# EAGLE design Adafruit CAN Bus FeatherWing (EAGLE 9.6.2)
COMPANY: Adafruit Industries; DRAWN: Bryan Siepert; REV: A
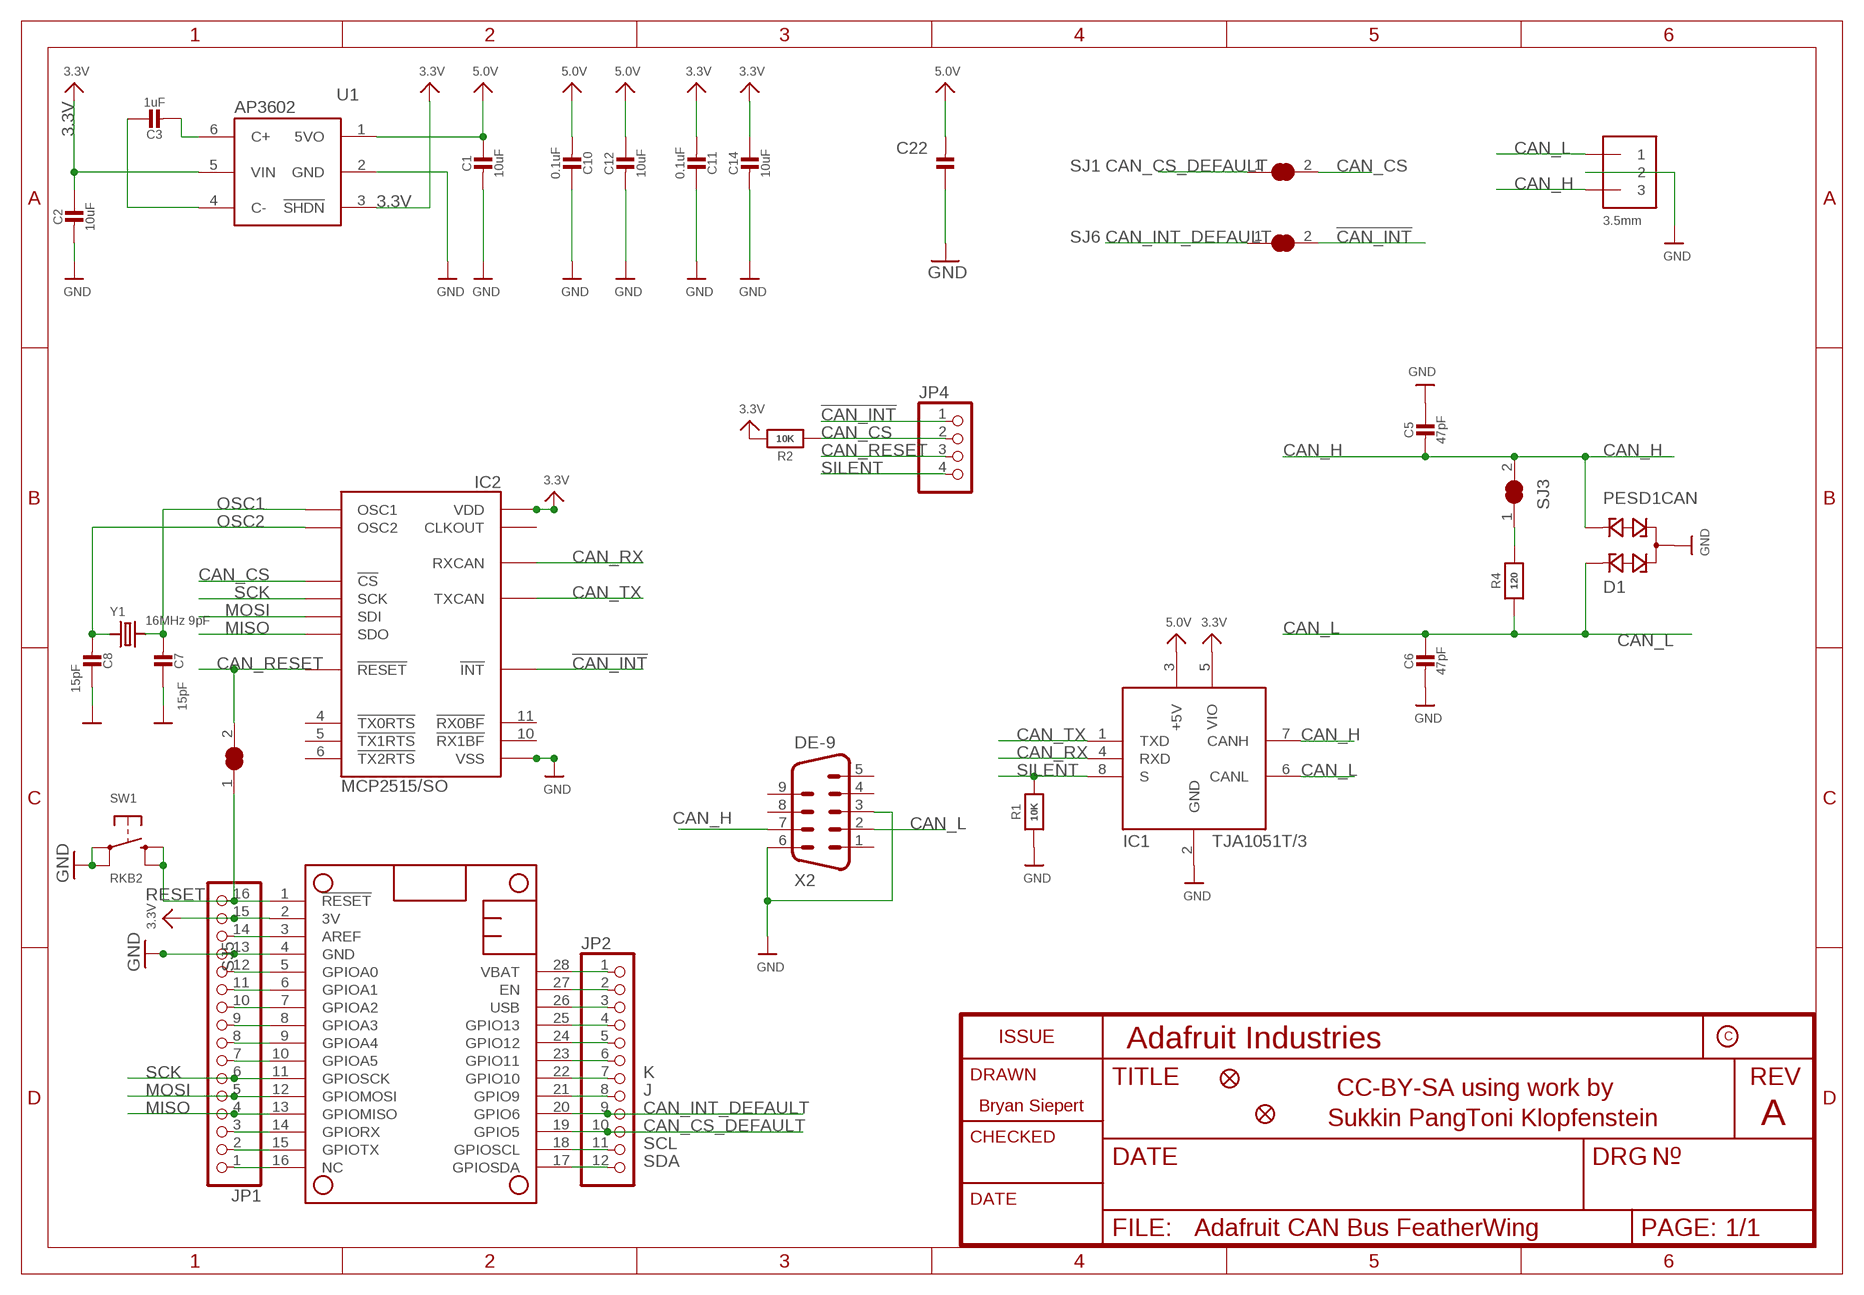
[diagram p0: schematic, sheet 1]

## Parts
C1  10uF  CAP_CERAMIC0805-NOOUTLINE  [0805-NO]
C2  10uF  CAP_CERAMIC0805-NOOUTLINE  [0805-NO]
C3  1uF  CAP_CERAMIC0805-NOOUTLINE  [0805-NO]
C5  47pF  CAP_CERAMIC0603_NO  [0603-NO]
C6  47pF  CAP_CERAMIC0603_NO  [0603-NO]
C7  15pF  CAP_CERAMIC0603_NO  [0603-NO]
C8  15pF  CAP_CERAMIC0603_NO  [0603-NO]
C10  0.1uF  CAP_CERAMIC0603_NO  [0603-NO]
C11  0.1uF  CAP_CERAMIC0603_NO  [0603-NO]
C12  10uF  CAP_CERAMIC0805-NOOUTLINE  [0805-NO]
C14  10uF  CAP_CERAMIC0805-NOOUTLINE  [0805-NO]
C22  0.1uF  CAP_CERAMIC0603_NO  [0603-NO]
D1  PESD1CAN  [SOT23]
FID2  FIDUCIAL_1MM  [FIDUCIAL_1MM]
FID3  FIDUCIAL_1MM  [FIDUCIAL_1MM]
IC1  TJA1051T/3  CAN_TRANSCIEVER_TCAN1051V  [SOIC8_150MIL]
IC2  MCP2515/SO  [SOIC18WIDE]
JP1  HEADER-1X16ROUND  [1X16_ROUND]
JP2  HEADER-1X12  [1X12_ROUND]
JP4  HEADER-1X4ROUND  [1X04_ROUND]
MS1  FEATHERWING_NODIM  [FEATHERWING_NODIM]
NEOPIX1  3.5mm  TERMBLOCK_1X3  [TERMBLOCK_1X3-3.5MM]
R1  10K  RESISTOR_0603_NOOUT  [0603-NO]
R2  10K  RESISTOR_0603_NOOUT  [0603-NO]
R4  120  RESISTOR_0603_NOOUT  [0603-NO]
SJ1  SOLDERJUMPER_CLOSED  [SOLDERJUMPER_CLOSEDWIRE]
SJ3  SOLDERJUMPER_CLOSED  [SOLDERJUMPER_CLOSEDWIRE]
SJ5  SOLDERJUMPER_CLOSED  [SOLDERJUMPER_CLOSEDWIRE]
SJ6  SOLDERJUMPER_CLOSED  [SOLDERJUMPER_CLOSEDWIRE]
SW1  RKB2  SWITCH_TACT_SMT_RKB2  [BTN_RKB2_4.6X2.8]
U1  AP3602  [SOT23-6]
X2  DE-9  M09D  [M09D]
Y1  16MHz 9pF  CRYSTAL3.2X2.5  [CRYSTAL_3.2X2.5]

## Nets
3.3V: C2.1 C11.2 C14.1 IC1.5(VIO) IC2.18(VDD) JP1.15 MS1.2(3V) R2.2 U1.3(!SHDN) U1.5(VIN)
5.0V: C1.1 C10.2 C12.1 C22.2 IC1.3(+5V) U1.1(5VO)
!CAN_INT: IC2.12(!INT) JP4.1 SJ6.2
A: JP1.12 MS1.5(GPIOA0)
AREF: JP1.14 MS1.3(AREF)
B: JP1.11 MS1.6(GPIOA1)
C: JP1.10 MS1.7(GPIOA2)
CAN_CS: IC2.16(!CS) JP4.2 R2.1 SJ1.2
CAN_CS_DEFAULT: JP2.10 MS1.19(GPIO5) SJ1.1
CAN_H: C5.2 D1.2 IC1.7(CANH) NEOPIX1.3 SJ3.2 X2.7
CAN_INT_DEFAULT: JP2.9 MS1.20(GPIO6) SJ6.1
CAN_L: C6.1 D1.1 IC1.6(CANL) NEOPIX1.1 R4.1 X2.2
CAN_RESET: IC2.17(!RESET) JP4.3 SJ5.2
CAN_RX: IC1.4(RXD) IC2.2(RXCAN)
CAN_TX: IC1.1(TXD) IC2.1(TXCAN)
D: JP1.9 MS1.8(GPIOA3)
E: JP1.8 MS1.9(GPIOA4)
EN: JP2.2 MS1.27(EN)
F: JP1.7 MS1.10(GPIOA5)
G: JP1.1 MS1.16(NC)
GND: C1.2 C2.2 C5.1 C6.2 C7.1 C8.1 C10.1 C11.1 C12.2 C14.2 C22.1 D1.3 IC1.2(GND) IC2.9(VSS) JP1.13 MS1.4(GND) NEOPIX1.2 R1.1 SW1.A'(P1) SW1.A(P) U1.2(GND) X2.3 X2.6
J: JP2.8 MS1.21(GPIO9)
K: JP2.7 MS1.22(GPIO10)
L: JP2.6 MS1.23(GPIO11)
M: JP2.5 MS1.24(GPIO12)
MISO: IC2.15(SDO) JP1.4 MS1.13(GPIOMISO)
MOSI: IC2.14(SDI) JP1.5 MS1.12(GPIOMOSI)
N: JP2.4 MS1.25(GPIO13)
N$1: C3.2 U1.6(C+)
N$2: C3.1 U1.4(C-)
N$3: R4.2 SJ3.1
OSC1: C7.2 IC2.8(OSC1) Y1.2
OSC2: C8.2 IC2.7(OSC2) Y1.1
RESET: JP1.16 MS1.1(!RESET) SJ5.1 SW1.B'(S1) SW1.B(S)
RX: JP1.3 MS1.14(GPIORX)
SCK: IC2.13(SCK) JP1.6 MS1.11(GPIOSCK)
SCL: JP2.11 MS1.18(GPIOSCL)
SDA: JP2.12 MS1.17(GPIOSDA)
SILENT: IC1.8(S) JP4.4 R1.2
TX: JP1.2 MS1.15(GPIOTX)
USB: JP2.3 MS1.26(USB)
VBAT: JP2.1 MS1.28(VBAT)
Unconnected: IC2.3(CLKOUT) IC2.4(!TX0RTS) IC2.5(!TX1RTS) IC2.6(!TX2RTS) IC2.10(!RX1BF) IC2.11(!RX0BF) X2.1 X2.4 X2.5 X2.8 X2.9

## Notes on the sheet
- CC-BY-SA using work by
- Toni Klopfenstein
- Sukkin Pang

## Library data of the parts
C1-C3 C5-C8 C10-C12 C14 C22 = microbuilder:CAP_CERAMIC: Ceramic Capacitors For new designs, use the packages preceded by an '_' character since they are more reliable: The following footprints should be used on most boards: _0402 - Standard footprint for regular board layouts _0603 - Standard footprint for regular board layouts _0805 - Standard footprint for regular board layouts _1206 - Standard footprint for regular board layouts For extremely tight-pitch boards where space is at a premium, the following 'micro-pitch' footprints can be used (smaller pads, no silkscreen outline, etc.): _0402MP - Micro-pitch footprint for very dense/compact boards _0603MP - Micro-pitch footprint for very dense/compact boards _0805MP - Micro-pitch footprint for very dense/compact boards _1206MP - Micro-pitch footprint for very dense/compact boards
D1 = diode:PESD1CAN: CAN bus ESD protection diode Source: http://www.nxp.com/documents/data_sheet/PESD1CAN.pdf
FID2 FID3 = microbuilder:FIDUCIAL: Fiducial Alignment Points Various fiducial points for machine vision alignment.; BOM: EXCLUDE
IC1 = microbuilder:CAN_TRANSCIEVER
IC2 = microbuilder:MCP2515
JP1 = microbuilder:HEADER-1X16: PIN HEADER
JP2 = microbuilder:HEADER-1X12
JP4 = microbuilder:HEADER-1X4: PIN HEADER
MS1 = microbuilder:FEATHERWING
NEOPIX1 = adafruit_electromech:TERMBLOCK_1X3: 3.5mm Terminal block http://www.ladyada.net/library/pcb/eaglelibrary.html
R1 R2 R4 = microbuilder:RESISTOR: Resistors For new designs, use the packages preceded by an '_' character since they are more reliable: The following footprints should be used on most boards: _0402 - Standard footprint for regular board layouts _0603 - Standard footprint for regular board layouts _0805 - Standard footprint for regular board layouts _1206 - Standard footprint for regular board layouts For extremely tight-pitch boards where space is at a premium, the following 'micro-pitch' footprints can be used (smaller pads, no silkscreen outline, etc.): _0402MP - Micro-pitch footprint for very dense/compact boards _0603MP - Micro-pitch footprint for very dense/compact boards _0805MP - Micro-pitch footprint for very dense/compact boards _1206MP - Micro-pitch footprint for very dense/compact boards
SJ1 SJ3 SJ5 SJ6 = microbuilder:SOLDERJUMPER_CLOSED: Solder Jumper - Closed These solder jumpers are closed by default CLOSEDWIRE - 10 mil trace between pads that can be cut and resoldered later CLOSEDPERM - 63 mil trace between pads for a permanent connection (used to 'bridge' two signals, a shameless hack for Eagle). Can double as a test point as well (no cream layer)
SW1 = adafruit_electromech:SWITCH_TACT_SMT: SMT Tact Switches RKB2 https://www.digikey.com/short/m027prz5
U1 = microbuilder:AP3602
X2 = adafruit_electromech:M09: SUB-D; OC_FARNELL: unknown; OC_NEWARK: unknown
Y1 = microbuilder:CRYSTAL: Crystals HC49UP - Surface Mount Crystal 4.0MHz 18pF +/-30ppm Surface Mount Crystal [Digikey: 535-9857-1-ND] 12.0 MHz Surface Mount Crystal [Digikey: 535-9869-6-ND] 25.0 MHz Surface Mount Crystal [Digikey: 535-9078-1-ND] 2.5 x 2.0mm - MEMs SMT Crystal 16.0 MHz 10pF 20ppm 2.5 x 2.0mm Crystal [Digikey -40-85°C: 535-10923-1-ND] 3.2 x 2.5mm - MEMs SMT Crystal 12.0 MHz 8pF 15ppm 3.2 x 2.5mm Crystal [Digikey: -10-70°C: 644-1047-1-ND -40-125°C: 644-1128-1-ND] 40~85°C cheaper: 644-1173-6-ND 16.0 MHz 8pF 15ppm 3.2 x 2.5mm Crystal [Digikey: -10-70°C: 644-1049-1-ND -40-125°C: 644-1129-2-ND]-40~85°C cheaper: 644-1175-6-ND 16.0 MHz 10pF 10ppm 3.2 x 2.5mm Crystal [Digikey: 644-1100-1-ND] 27.12 MHz 18pF 30ppm 3.2 x 2.5mm Crystal [Digikey: 887-1424-1-ND] 27.12MHz 10pF 10ppm 3.2 x 2.5mm Crystal [Digikey: 887-1329-1-ND] 4.9 x 1.8mm - MEMs SMT Crystal 32.768 KHz 12.5pF 20ppm 4.9 x 1.8mm Crystal [Digikey: SE2415CT-ND] 8.0 x 3.8mm - Surface Mount Crystal 32.768kHz 12.5pF 20ppm -40°C-85°C [Digikey: 535-9166-2-ND] Cylinder 32.768KHz Cylinder Crystal (2x6mm body) [Ex. Digikey: 300-8341-2-ND]

## Net classes
1 power: width 0.305 mm
2 thickpower: width 0.406 mm

## Board
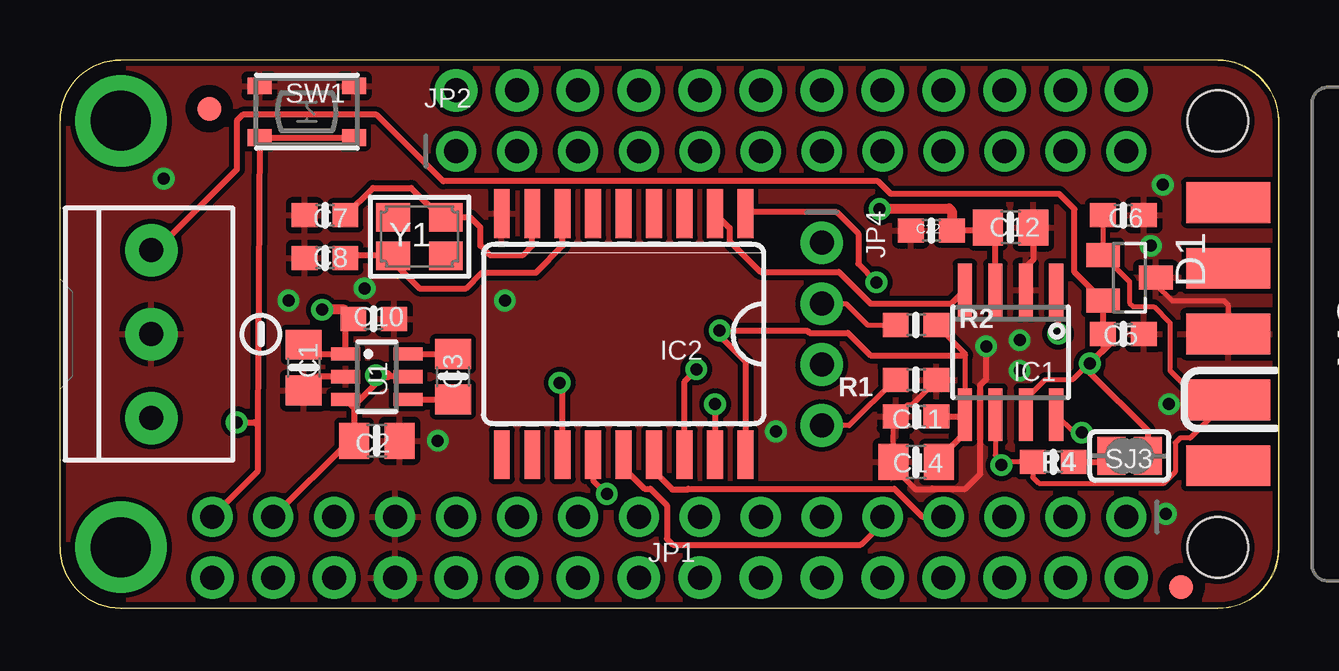
[diagram p1: board, top side]
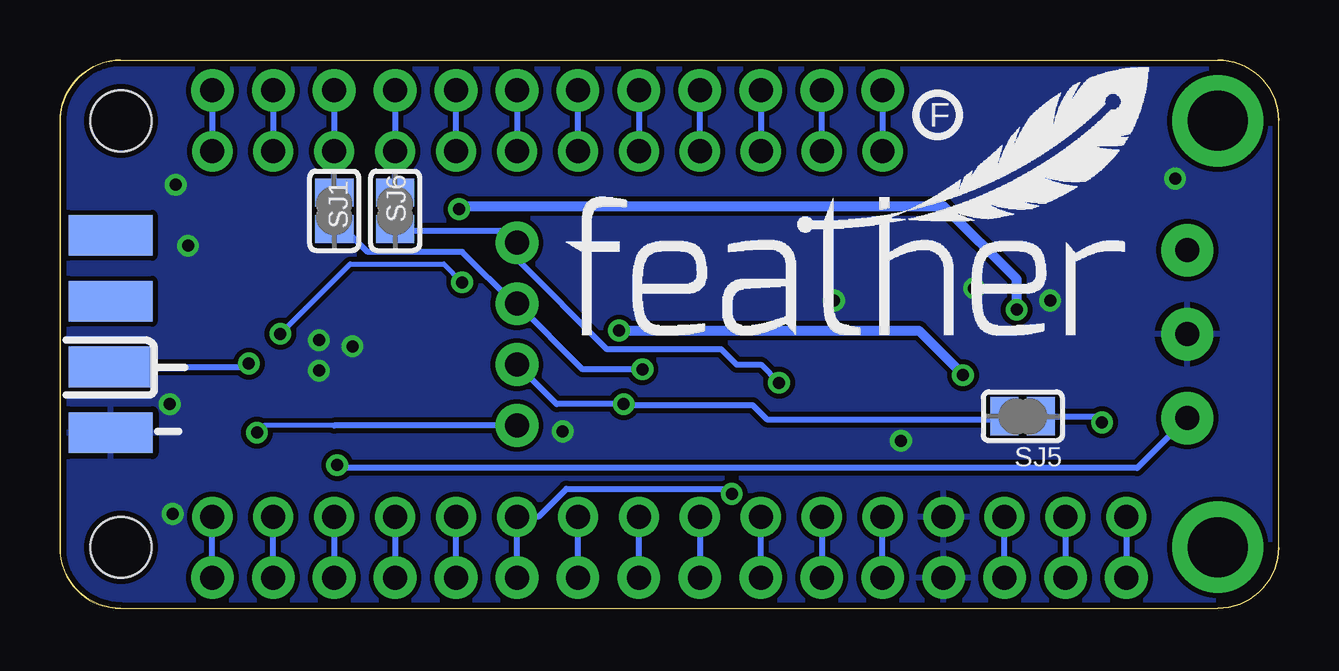
[diagram p2: board, bottom side, seen from below]

Size 50.8 x 22.86 mm. Coordinates in mm from the lower left corner, seen from the top.
Outline: 48.26,0 2.54,0
Outline: 2.54,0 arc-90 0,2.54
Outline: 0,2.54 0,20.32
Outline: 0,20.32 arc-90 2.54,22.86
Outline: 48.26,22.86 arc-90 50.8,20.19 50.8,2.41 arc-90 48.26,0
Outline: 0,2.54 arc90 2.54,0
Outline: 48.26,0 arc90 50.8,2.54 50.8,20.32 arc90 48.26,22.86
Outline: 48.26,22.86 2.54,22.86
Outline: 2.54,22.86 arc90 0,20.32
Copper layers (1*16): Top 0.035mm / dielectric 1.5mm / Bottom 0.035mm
Design rules "adafruit": minimum track width 8mil, minimum drill 15.5mil, track to track 8mil, track to pad 8mil, pad to pad 8mil, via to via 8mil, smd to smd 8mil, copper to edge 10mil, drill to drill 8mil, minimum pad ring 10mil, minimum via ring 8mil, stop-mask expansion 2mil, vias tented up to drill 20mil, thermal gap 10mil

### Footprints (pad centres in the part's own frame; a part is rotated, then mirrored left to right if it is on the bottom)
0805-NO = smd 1.24 x 1.5: 1 -0.95,0; 2 0.95,0
0603-NO = smd 1.075 x 1: 1 -0.85,0; 2 0.85,0
SOT23 = smd 1 x 1.4: 1 -0.95,-1.1; 2 0.95,-1.1; 3 0,1.1
FIDUCIAL_1MM = smd 1 x 1: 1 0,0
SOIC8_150MIL = smd 0.6 x 2.2: 1 -1.905,-2.6; 2 -0.635,-2.6; 3 0.635,-2.6; 4 1.905,-2.6; 5 1.905,2.6; 6 0.635,2.6; 7 -0.635,2.6; 8 -1.905,2.6
SOIC18WIDE = smd 0.66 x 2.032: 1 -5.08,-5.029; 2 -3.81,-5.029; 3 -2.54,-5.029; 4 -1.27,-5.029; 5 0,-5.029; 6 1.27,-5.029; 7 2.54,-5.029; 8 3.81,-5.029; 9 5.08,-5.029; 10 5.08,5.029; 11 3.81,5.029; 12 2.54,5.029; 13 1.27,5.029; 14 0,5.029; 15 -1.27,5.029; 16 -2.54,5.029; 17 -3.81,5.029; 18 -5.08,5.029
1X16_ROUND = drill 1 pad 1.676: 1 -19.05,0; 2 -16.51,0; 3 -13.97,0; 4 -11.43,0; 5 -8.89,0; 6 -6.35,0; 7 -3.81,0; 8 -1.27,0; 9 1.27,0; 10 3.81,0; 11 6.35,0; 12 8.89,0; 13 11.43,0; 14 13.97,0; 15 16.51,0; 16 19.05,0
1X12_ROUND = drill 1 pad 1.676: 1 -13.97,0; 2 -11.43,0; 3 -8.89,0; 4 -6.35,0; 5 -3.81,0; 6 -1.27,0; 7 1.27,0; 8 3.81,0; 9 6.35,0; 10 8.89,0; 11 11.43,0; 12 13.97,0
1X04_ROUND = drill 1 pad 1.778: 1 -3.81,0; 2 -1.27,0; 3 1.27,0; 4 3.81,0
FEATHERWING_NODIM = drill 1 pad 1.778: 1 6.35,1.27; 2 8.89,1.27; 3 11.43,1.27; 4 13.97,1.27; 5 16.51,1.27; 6 19.05,1.27; 7 21.59,1.27; 8 24.13,1.27; 9 26.67,1.27; 10 29.21,1.27; 11 31.75,1.27; 12 34.29,1.27; 13 36.83,1.27; 14 39.37,1.27; 15 41.91,1.27; 16 44.45,1.27; 17 44.45,21.59; 18 41.91,21.59; 19 39.37,21.59; 20 36.83,21.59; 21 34.29,21.59; 22 31.75,21.59; 23 29.21,21.59; 24 26.67,21.59; 25 24.13,21.59; 26 21.59,21.59; 27 19.05,21.59; 28 16.51,21.59 | drill 2.5 pad 3.81: P$1 2.54,20.32; P$2 2.54,2.54 | hole 2.54: 48.26,20.32; 48.26,2.54
TERMBLOCK_1X3-3.5MM = drill 1 pad 2.184: 1 3.5,0; 2 0,0; 3 -3.5,0
SOLDERJUMPER_CLOSEDWIRE = smd 1.168 x 1.6: 1 -0.762,0; 2 0.762,0 | smd 0.635 x 0.203: WIRE 0,0
BTN_RKB2_4.6X2.8 = smd 1 x 0.7: A 1.973,1.075; A' -1.973,1.075; B 1.973,-1.075; B' -1.973,-1.075
SOT23-6 = smd 0.55 x 1.2: 1 -0.95,-1.3; 2 0,-1.3; 3 0.95,-1.3; 4 0.95,1.3; 5 0,1.3; 6 -0.95,1.3
M09D = smd 1.7 x 3.5: 1 5.486,-6.045; 2 2.743,-6.045; 3 0,-6.045; 4 -2.743,-6.045; 5 -5.486,-6.045 | smd 1.7 x 3.5 bottom: 6 4.115,-6.045; 7 1.372,-6.045; 8 -1.372,-6.045; 9 -4.115,-6.045
CRYSTAL_3.2X2.5 = smd 1.4 x 1.2: 1 -1.1,-0.8; 2 1.1,0.8; GND1 -1.1,0.8; GND2 1.1,-0.8

### Placement (x,y rotation side)
C1  10.16,10.03 270 top
C2  13.21,6.99 0 top
C3  16.38,9.65 90 top
C5  44.32,11.43 180 top
C6  44.32,16.38 0 top
C7  11.05,16.38 0 top
C8  11.05,14.61 0 top
C10  13.08,12.06 180 top
C11  35.69,8 0 top
C12  39.62,15.88 0 top
C14  35.69,6.1 180 top
C22  36.32,15.75 0 top
D1  44.58,13.78 270 top
FID2  6.22,20.83 0 top
FID3  46.74,0.89 0 top
IC1  39.62,10.67 180 top
IC2  23.5,11.43 180 top
JP1  25.4,3.81 180 top
JP2  30.48,19.05 0 top
JP4  31.75,11.43 270 top
MS1  0,0 0 top
NEOPIX1  3.81,11.43 270 top
PLABEL0  [PLABEL0]  10.29,18.41 0 top
PLABEL1  [PLABEL1]  8.38,7.62 90 top
PLABEL2  [PLABEL2]  8.26,15.11 90 top
PLABEL3  [PLABEL3]  42.29,9.53 0 top
PLABEL4  [PLABEL4]  33.91,11.68 90 top
PLABEL5  [PLABEL5]  30.61,14.35 90 top
PLABEL6  [PLABEL6]  30.61,8.76 90 top
PLABEL8  [PLABEL8]  37.47,14.73 270 bottom
PLABEL9  [PLABEL9]  40.01,14.61 270 bottom
PLABEL10  [PLABEL10]  45.47,9.4 0 bottom
PLABEL11  [PLABEL11]  45.59,6.86 0 bottom
PLABEL12  [PLABEL12]  12.32,5.46 0 bottom
PLABEL13  [PLABEL13]  29.21,6.1 0 bottom
PLABEL14  [PLABEL14]  43.81,11.05 90 bottom
PLABEL15  [PLABEL15]  33.91,5.71 90 top
PLABEL16  [PLABEL16]  42.16,7.75 0 top
R1  35.69,9.53 180 top
R2  35.69,11.81 0 top
R4  41.4,6.1 0 top
SJ1  39.37,16.57 270 bottom
SJ3  44.58,6.35 0 top
SJ5  10.67,8 180 bottom
SJ6  36.83,16.57 270 bottom
SW1  10.29,20.7 0 top
U1  13.21,9.65 270 top
U$21  [SYMBOL_MINUS]  8.38,11.43 90 top
U$22  [FEATHERLOGO]  29.72,11.3 0 bottom
U$33  [PCBFEAT-REV-040]  14.22,20.57 0 bottom
X2  54.74,11.43 270 top
Y1  14.99,15.49 0 top

### Tracks (layer width: path | path; a pad name or v marks a point on that pad's centre or on a via)
3.3V  (via drill 0.5)
  Top 0.203: R2.2 37.72,10.63 37.72,10.54 IC1.5
  Top 0.254: U1.3 12.02,8.59 | 12.02,8.59 12.26,8.35 C2.1 12.06,6.99 JP1.15 | U1.5 13.59,9.65 | 13.59,9.65 13.46,9.65 12.4,8.59 12.02,8.59 | 13.65,9.72 13.59,9.65 | 27.3,11.43 27.43,11.43 28.57,10.29 IC2.18 | C14.1 36.57,6.16 37.72,7.31 37.72,7.75 | 37.72,7.75 37.47,8 C11.2 | v27.5,11.58 31.15,11.58 31.25,11.48 32.84,11.48 33.78,10.54 37.72,10.54 | IC1.5 37.72,7.75
  Top 0.406: 27.3,11.43 27.45,11.58 v27.5,11.58 | v13.16,9.72 13.65,9.72
  Bottom 0.254: JP1.15 MS1.2
  Bottom 0.406: v27.5,11.58 15.01,11.58 13.21,9.78 13.21,9.76 v13.16,9.72
5.0V  (via drill 0.5)
  Top 0.254: C1.1 10.54,10.6 U1.1 11.91,11.74 C10.2 | IC1.3 38.99,15.56 C12.1 38.55,15.75 C22.2
  Top 0.406: C10.2 11.85,12.45 v10.92,12.45 | v34.16,16.64 34.19,16.66 37.06,16.66 37.17,16.55 C22.2
  Bottom 0.406: v10.92,12.45 10.92,13.72 13.97,16.76 34.04,16.76 v34.16,16.64
!CAN_INT  (via drill 0.5)
  Top 0.254: IC2.12 20.95,9.27 v20.83,9.4
  Bottom 0.254: SJ6.2 36.32,15.81 36.26,15.75 32.26,15.75 JP4.1 31.75,14.55 27.99,10.79 23.23,10.79 22.59,10.16 21.59,10.16 v20.83,9.4
A
  Bottom 0.254: MS1.5 JP1.12
AREF
  Bottom 0.254: MS1.3 JP1.14
B
  Bottom 0.254: JP1.11 MS1.6
C
  Bottom 0.254: MS1.7 JP1.10
CAN_CS  (via drill 0.5)
  Top 0.203: JP4.2 32.77,12.7 33.66,11.81 R2.1
  Top 0.254: IC2.16 26.04,9.45 26.54,9.95 v26.52,9.96
  Bottom 0.254: SJ1.2 38.92,15.81 37.97,14.86 34.04,14.86 31.88,12.7 JP4.2 29.01,9.96 v26.52,9.96
CAN_CS_DEFAULT
  Bottom 0.254: SJ1.1 JP2.10 MS1.19
CAN_H  (via drill 0.5)
  Top 0.203: IC1.7 40.26,8.73 41.07,9.54 42.21,9.54 43.47,10.79 C5.2
  Top 0.254: SJ3.2 45.34,7.41 42.93,9.82 v42.93,10.2 43.81,11.09 C5.2 D1.2 42.29,14.02 42.29,16.64 41.66,17.27 34.64,17.27 34.1,17.8 15.98,17.8 13.21,20.57 7.62,20.57 7.37,20.32 7.37,18.29 4.01,14.93 NEOPIX1.3
  Bottom 0.254: X2.7 43.07,10.06 v42.93,10.2
CAN_INT_DEFAULT
  Bottom 0.254: SJ6.1 JP2.9 MS1.20
CAN_L  (via drill 0.5)
  Top 0.203: 39.24,6.1 R4.1 40.55,5.46 40.81,5.21 46.01,5.21 46.48,5.68 46.48,6.89 46.69,7.1 47.1,7.1 X2.2 | 39.14,6.24 38.99,6.39 IC1.6 | 48.64,8.69 48.31,9.02 47.16,9.02 46.27,9.91 46.27,11.9 45.59,12.57 44.74,12.57 44.58,12.73 44.58,13.63 D1.1 C6.1
  Top 0.254: X2.2 48.64,8.69 | 39.24,6.1 v39.24,5.97 39.24,6.13 39.14,6.24
  Bottom 0.254: NEOPIX1.1 5.9,5.84 39.12,5.84 v39.24,5.97
CAN_RESET  (via drill 0.5)
  Top 0.254: v27.3,8.51 IC2.17
  Bottom 0.254: SJ5.2 11.56,7.87 21.34,7.87 21.93,8.47 27.26,8.47 v27.3,8.51 30.1,8.51 JP4.3
CAN_RX
  Top 0.254: IC2.2 27.91,15.85 27.91,15.31 29.2,14.02 32.46,14.02 33.78,12.7 37.15,12.7 IC1.4
CAN_TX  (via drill 0.5)
  Top 0.203: IC1.1 41.61,13.18 v41.61,11.44
  Top 0.254: v34.04,13.59 33.27,14.35 33.27,15.62 32.38,16.51 28.63,16.51 IC2.1
  Bottom 0.203: v34.04,13.59 34.8,14.35 38.7,14.35 v41.61,11.44
D
  Bottom 0.254: JP1.9 MS1.8
E
  Bottom 0.254: MS1.9 JP1.8
EN
  Bottom 0.254: JP2.2 MS1.27
F
  Bottom 0.254: MS1.10 JP1.7
G
  Bottom 0.254: MS1.16 JP1.1
GND  (via drill 0.5)
  Top 0.203: C14.2 34.74,8 C11.1 35.3,8.47 35.5,8.47 36.54,9.5 R1.1 | D1.3 45.68,13.51 46.35,12.83 48.51,12.83 48.69,12.65 X2.3
  Top 0.254: U1.2 10.73,9.65 C1.2 | C14.2 34.74,5.9 35.69,4.95 36.32,4.95 36.35,4.98 37.74,4.98 38.36,5.59 38.36,9.3 38.61,9.55 v38.61,10.92 | C12.2 40.57,14.54 40.26,14.22 IC1.2
  other vias: 40.01,11.18 45.97,17.65 45.47,15.11 46.1,3.94 18.54,12.83 29.84,7.37 15.75,6.99 9.53,12.83 12.7,13.34 4.32,17.91 40.01,9.91 46.23,8.51
  pour Top: 0,22.86 50.8,22.86 50.8,0 0,0
  pour Bottom: 0,22.86 50.8,22.86 50.8,0 0,0
J
  Bottom 0.254: JP2.8 MS1.21
K
  Bottom 0.254: MS1.22 JP2.7
L
  Bottom 0.254: JP2.6 MS1.23
M
  Bottom 0.254: MS1.24 JP2.5
MISO
  Top 0.254: IC2.15 24.77,5.71 25.53,4.95 26.16,4.95 26.19,4.98 34.77,4.98 35.94,3.81 JP1.4
  Bottom 0.254: JP1.4 MS1.13
MOSI
  Top 0.254: IC2.14 23.5,5.86 24.37,4.98 24.61,4.98 25.3,4.29 25.3,2.9 25.55,2.64 33.38,2.64 34.29,3.56 JP1.5
  Bottom 0.254: MS1.12 JP1.5
N
  Bottom 0.254: JP2.4 MS1.25
N$1
  Top 0.254: U1.6 C3.2
N$2
  Top 0.254: U1.4 C3.1
N$3
  Top 0.254: R4.2 43.56,6.1 SJ3.1
OSC1
  Top 0.254: C7.2 13.04,17.53 14.64,17.53 15.88,16.29 Y1.2 16.13,16.29 17.11,16.29 17.53,15.88 17.53,15.11 17.91,14.73 19.3,14.73 19.68,15.11 IC2.8
OSC2
  Top 0.254: IC2.7 20.95,15.11 19.83,13.99 17.58,13.99 16.93,13.34 14.99,13.34 13.89,14.44 Y1.1 11.99,14.69 C8.2
RESET  (via drill 0.5)
  Top 0.254: SW1.B SW1.B' 8.24,7.62 | 8.24,7.62 8.24,5.7 JP1.16 | v7.37,7.75 8.11,7.75 8.24,7.62
  Bottom 0.254: JP1.16 MS1.1 | SJ5.1 7.62,8 v7.37,7.75
RX
  Bottom 0.254: JP1.3 MS1.14
SCK  (via drill 0.5)
  Top 0.254: v22.8,4.76 22.23,5.33 IC2.13
  Bottom 0.254: MS1.11 JP1.6 30.86,3.81 29.69,4.98 23.01,4.98 v22.8,4.76
SCL
  Bottom 0.254: MS1.18 JP2.11
SDA
  Bottom 0.254: MS1.17 JP2.12
SILENT  (via drill 0.5)
  Top 0.203: IC1.8 42.28,7.32 v42.59,7.32 | R1.2 34.8,9.53 32.89,7.62 JP4.4
  Bottom 0.203: 39.37,7.62 42.29,7.62 v42.59,7.32
  Bottom 0.254: JP4.4 39.37,7.62
TX
  Bottom 0.254: MS1.15 JP1.2
USB
  Bottom 0.254: MS1.26 JP2.3
VBAT
  Bottom 0.254: MS1.28 JP2.1

### Text on the board
Pinguin_tBackup: Reset | CANH | INT | CS | RST | CANL | TERM | CANL | SLNT | STBY
Pinguin_bBackup: INT | CS | Optional / DE-9 | RST | CAN-H | CAN Bus Wing / MCP2515 SPI | GND